# Altium project PCB Blue Pill.PrjPcb
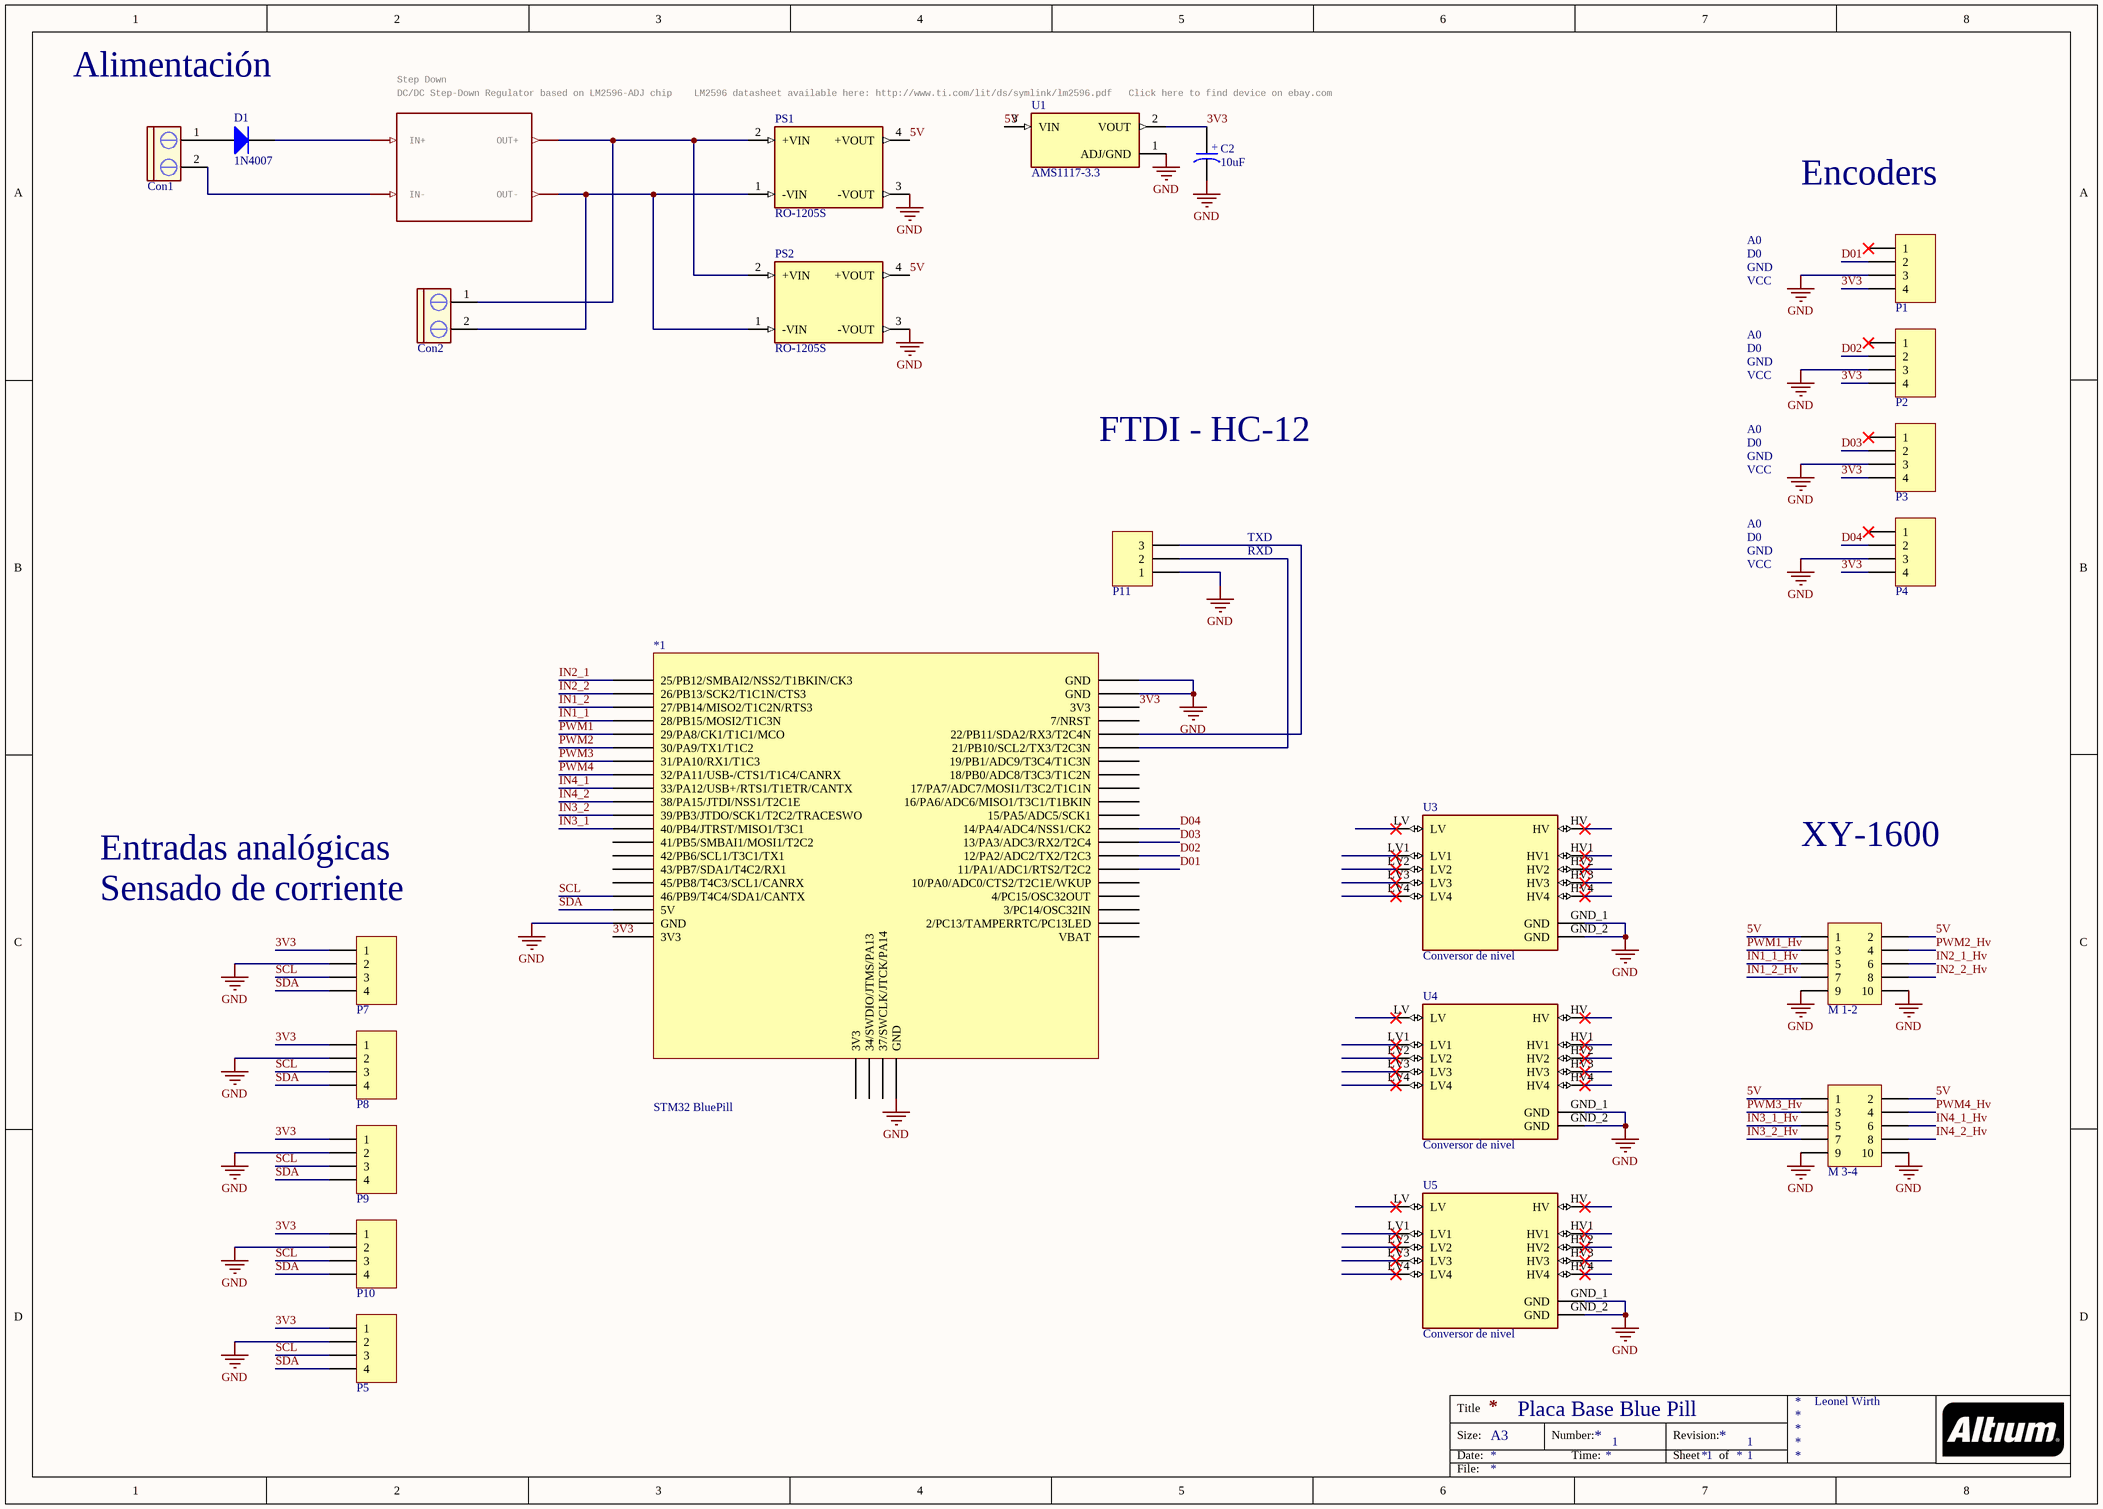
[diagram p0: Placa Base Blue Pill.SchDoc]
1 sheet, 24 parts. Net scope: global (net labels, ports and power ports of the same name join across sheets).
Board file: PCB Placa Base Blue Pill.PcbDoc

## Sheet Placa Base Blue Pill.SchDoc
size A3

### Parts
*1  STM32 BluePill  [STM32 BluePill]
C2  value 10uF  [CAPRADIAL 6.3X11 - 10u]  (hidden comment: CAP- ELECT)
Con1  CON2 pin blue  [BORNE 2P]  (value not drawn)
Con2  CON2 pin blue  [BORNE 2P]  (value not drawn)
D1  1N4007  [DO - 41]
M_1-2  Header 5x2  [2x05 header]  (value not drawn)
M_3-4  Header 5x2  [2x05 header]  (value not drawn)
P1  Header 4  [1X04]  (value not drawn)
P2  Header 4  [1X04]  (value not drawn)
P3  Header 4  [1X04]  (value not drawn)
P4  Header 4  [1X04]  (value not drawn)
P5  Header 4  [1X04]  (value not drawn)
P7  Header 4  [1X04]  (value not drawn)
P8  Header 4  [1X04]  (value not drawn)
P9  Header 4  [1X04]  (value not drawn)
P10  Header 4  [1X04]  (value not drawn)
P11  Header 3  [1X03]  (value not drawn)
PS1  RO-1205S  [CONV_RO-1205S]
PS2  RO-1205S  [CONV_RO-1205S]
Step_Down  DC/DC Step-Down Regulator based on LM2596-ADJ chip    LM2596 datasheet available here: http://www.ti.com/lit/ds/symlink/lm2596.pdf   Click here to find device on ebay.com  [DC-DC-STEP-DOWN-LM2596]
U1  AMS1117-3.3  [SOT229P700X180-4N]
U3  Conversor de nivel  [CONV_BOB-12009]
U4  Conversor de nivel  [CONV_BOB-12009]
U5  Conversor de nivel  [CONV_BOB-12009]

### Nets
GND: *1.1(GND) *1.2(GND) *1.21(GND) *1.26(GND) C2.2 M_1-2.9 M_1-2.10 M_3-4.9 M_3-4.10 P1.3 P2.3 P3.3 P4.3 P5.2 P7.2 P8.2 P9.2 P10.2 P11.1 PS1.3(-VOUT) PS2.3(-VOUT) U1.1(ADJ/GND) U3.GND_1(GND) U3.GND_2(GND) U4.GND_1(GND) U4.GND_2(GND) U5.GND_1(GND) U5.GND_2(GND)
3V3: *1.3(3V3) *1.25(3V3) C2.1 P1.4 P2.4 P3.4 P4.4 P5.1 P7.1 P8.1 P9.1 P10.1 U1.2(VOUT)
5V: M_1-2.1 M_1-2.2 M_3-4.1 M_3-4.2 PS1.4(+VOUT) PS2.4(+VOUT) U1.3(VIN)
D01: *1.15(11/PA1/ADC1/RTS2/T2C2) P1.2
D02: *1.14(12/PA2/ADC2/TX2/T2C3) P2.2
D03: *1.13(13/PA3/ADC3/RX2/T2C4) P3.2
D04: *1.12(14/PA4/ADC4/NSS1/CK2) P4.2
IN1_1: *1.41(28/PB15/MOSI2/T1C3N)
IN1_1_Hv: M_1-2.5
IN1_2: *1.42(27/PB14/MISO2/T1C2N/RTS3)
IN1_2_Hv: M_1-2.7
IN2_1: *1.44(25/PB12/SMBAI2/NSS2/T1BKIN/CK3)
IN2_1_Hv: M_1-2.6
IN2_2: *1.43(26/PB13/SCK2/T1C1N/CTS3)
IN2_2_Hv: M_1-2.8
IN3_1: *1.33(40/PB4/JTRST/MISO1/T3C1)
IN3_1_Hv: M_3-4.5
IN3_2: *1.34(39/PB3/JTDO/SCK1/T2C2/TRACESWO)
IN3_2_Hv: M_3-4.7
IN4_1: *1.36(33/PA12/USB+/RTS1/T1ETR/CANTX)
IN4_1_Hv: M_3-4.6
IN4_2: *1.35(38/PA15/JTDI/NSS1/T2C1E)
IN4_2_Hv: M_3-4.8
PWM1: *1.40(29/PA8/CK1/T1C1/MCO)
PWM1_Hv: M_1-2.3
PWM2: *1.39(30/PA9/TX1/T1C2)
PWM2_Hv: M_1-2.4
PWM3: *1.38(31/PA10/RX1/T1C3)
PWM3_Hv: M_3-4.3
PWM4: *1.37(32/PA11/USB-/CTS1/T1C4/CANRX)
PWM4_Hv: M_3-4.4
SCL: *1.28(46/PB9/T4C4/SDA1/CANTX) P5.3 P7.3 P8.3 P9.3 P10.3
SDA: *1.27(5V) P5.4 P7.4 P8.4 P9.4 P10.4
Net*1_5: *1.5(22/PB11/SDA2/RX3/T2C4N) P11.3
Net*1_6: *1.6(21/PB10/SCL2/TX3/T2C3N) P11.2
NetCon1_1: Con1.1 D1.A
NetCon1_2: Con1.2 Step_Down.IN-
NetCon2_1: Con2.1 PS1.2(+VIN) PS2.2(+VIN) Step_Down.OUT+
NetCon2_2: Con2.2 PS1.1(-VIN) PS2.1(-VIN) Step_Down.OUT-
NetD1_K: D1.K Step_Down.IN+

Not connected (* = marked no-connect by the designer): *1 4(7/NRST) 7(19/PB1/ADC9/T3C4/T1C3N) 8(18/PB0/ADC8/T3C3/T1C2N) 9(17/PA7/ADC7/MOSI1/T3C2/T1C1N) 10(16/PA6/ADC6/MISO1/T3C1/T1BKIN) 11(15/PA5/ADC5/SCK1) 16(10/PA0/ADC0/CTS2/T2C1E/WKUP) 17(4/PC15/OSC32OUT) 18(3/PC14/OSC32IN) 19(2/PC13/TAMPERRTC/PC13LED) 20(VBAT) 22(37/SWCLK/JTCK/PA14) 23(34/SWDIO/JTMS/PA13) 24(3V3) 29(45/PB8/T4C3/SCL1/CANRX) 30(43/PB7/SDA1/T4C2/RX1) 31(42/PB6/SCL1/T3C1/TX1) 32(41/PB5/SMBAI1/MOSI1/T2C2); P1 1*; P2 1*; P3 1*; P4 1*; U3 HV* HV1* HV2* HV3* HV4* LV* LV1* LV2* LV3* LV4*; U4 HV* HV1* HV2* HV3* HV4* LV* LV1* LV2* LV3* LV4*; U5 HV* HV1* HV2* HV3* HV4* LV* LV1* LV2* LV3* LV4*

### Notes on the sheet
- Alimentación
- A0
- Encoders
- D0
- GND
- VCC
- FTDI - HC-12
- RXD
- TXD
- XY-1600
- Entradas analógicas
- (near P7) Sensado de corriente
- Placa Base Blue Pill
- 1
- Leonel Wirth
- Title
- Size:
- Date:
- A3
- Number:
- Time:
- Revision:
- Sheet
- of
- File:
- (in symbol Capacitor Electrolitico) +

### Library data of the parts
C2 = Capacitor Electrolitico: CAP_AXIAL
Con1 Con2 = CON2 pin blue: Connector blue screw
D1 = 1N4007: 1 Amp Diode
M_1-2 M_3-4 = Header 5x2: Header, 5-Pin, Dual row
P1-P5 P7-P10 = Header 4: Header, 4-Pin; LatestRevisionDate: 17-Jul-2002; LatestRevisionNote: Re-released for DXP Platform.; Publisher: Altium Limited
P11 = Header 3: Header, 3-Pin; LatestRevisionDate: 17-Jul-2002; LatestRevisionNote: Re-released for DXP Platform.; Publisher: Altium Limited
PS1 PS2 = RO-1205S: 1W DC/DC-Converter 'ECONOLINE' SIP4 1kV unreg; MF: Recom Power; Package: SIP-4 Recom Power; Value: *; MP: RO-1205S; Availability: Unavailable; SnapEDA_Link: https://www.snapeda.com/parts/RO-1205S/Recom%20Power/view-part/280650/?ref=snap; Price: None
Step_Down = DC-DC-STEP-DOWN-LM2596: Step Down; GateName_1: G$1; SymbolName_1: DC-DC-STEP-DOWN-LM2596; LibraryName: diy-modules (1); DeviceSetName: DC-DC-STEP-DOWN-LM2596; Package: DC-DC-STEP-DOWN-LM2596
U1 = AMS1117-3.3: Sot223/Pkg 1-Amp 3.3-Volt Low Drop Out Voltage Regulatator; MF: {'manufacturer': u'NEC'}; Package: None; Price: None; MP: AMS1117-3.3; Availability: Unavailable; Value: *
U3-U5 = Conversor de nivel: BSS138 Logic-Level Translator Interface Evaluation Board; MP: BOB-12009; MF: SparkFun; Price: None; Availability: Unavailable; SnapEDA_Link: https://www.snapeda.com/parts/BOB-12009/SparkFun%20Electronics/view-part/551764/?ref=snap; Value: *; Package: None